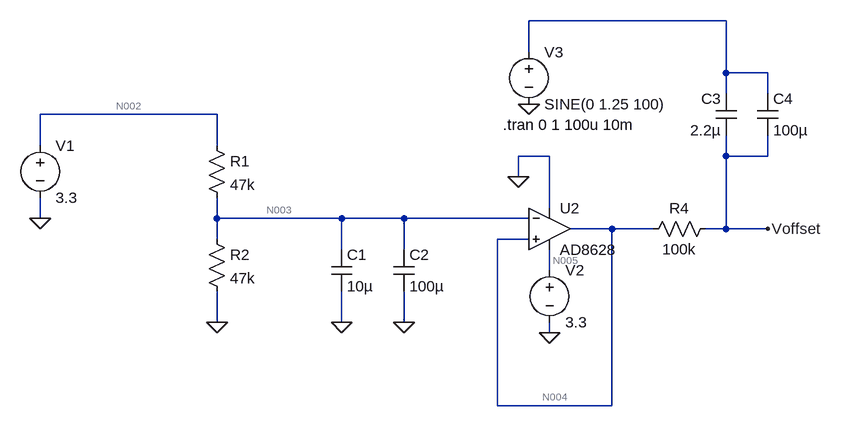
[diagram p0: schematic Voffset_1_65_V.asc]
Voffset_1_65_V.asc, the LTspice schematic file:
Version 4.1
SHEET 1 1412 680
WIRE 1072 -192 768 -192
WIRE 768 -144 768 -192
WIRE 1072 -112 1072 -192
WIRE 1136 -112 1072 -112
WIRE 1072 -80 1072 -112
WIRE 1136 -80 1136 -112
WIRE 288 -48 16 -48
WIRE 16 0 16 -48
WIRE 288 0 288 -48
WIRE 800 16 752 16
WIRE 1072 16 1072 -16
WIRE 1136 16 1136 -16
WIRE 1136 16 1072 16
WIRE 752 48 752 16
WIRE 800 96 800 16
WIRE 16 112 16 80
WIRE 288 112 288 80
WIRE 480 112 288 112
WIRE 576 112 480 112
WIRE 768 112 576 112
WIRE 896 128 832 128
WIRE 960 128 896 128
WIRE 1072 128 1072 16
WIRE 1072 128 1040 128
WIRE 1136 128 1072 128
WIRE 288 144 288 112
WIRE 768 144 720 144
WIRE 480 160 480 112
WIRE 576 160 576 112
WIRE 800 192 800 160
WIRE 288 272 288 224
WIRE 480 272 480 224
WIRE 576 272 576 224
WIRE 800 288 800 272
WIRE 720 400 720 144
WIRE 896 400 896 128
WIRE 896 400 720 400
FLAG 16 112 0
FLAG 288 272 0
FLAG 480 272 0
FLAG 576 272 0
FLAG 1136 128 Voffset
FLAG 800 288 0
FLAG 752 48 0
FLAG 768 -64 0
SYMBOL voltage 16 -16 R0
WINDOW 123 0 0 Left 0
WINDOW 39 0 0 Left 0
SYMATTR InstName V1
SYMATTR Value 3.3
SYMBOL res 272 -16 R0
SYMATTR InstName R1
SYMATTR Value 47k
SYMBOL res 272 128 R0
SYMATTR InstName R2
SYMATTR Value 47k
SYMBOL cap 464 160 R0
SYMATTR InstName C1
SYMATTR Value 10µ
SYMBOL cap 560 160 R0
SYMATTR InstName C2
SYMATTR Value 100µ
SYMBOL voltage 800 176 R0
WINDOW 123 0 0 Left 0
WINDOW 39 0 0 Left 0
SYMATTR InstName V2
SYMATTR Value 3.3
SYMBOL OpAmps\\AD8628 800 64 R0
SYMATTR InstName U2
SYMBOL voltage 768 -160 R0
WINDOW 123 0 0 Left 0
WINDOW 39 0 0 Left 0
SYMATTR InstName V3
SYMATTR Value SINE(0 1.25 100)
SYMBOL res 1056 112 R90
WINDOW 0 0 56 VBottom 2
WINDOW 3 32 56 VTop 2
SYMATTR InstName R4
SYMATTR Value 100k
SYMBOL cap 1088 -16 R180
WINDOW 0 24 56 Left 2
WINDOW 3 24 8 Left 2
SYMATTR InstName C3
SYMATTR Value 2.2µ
SYMBOL cap 1120 -80 R0
SYMATTR InstName C4
SYMATTR Value 100µ
TEXT 728 -32 Left 2 !.tran 0 1 100u 10m

The netlist it stands for:
* Voffset_1_65_V.asc
V1 N002 0 3.3
R1 N002 N003 47k
R2 N003 0 47k
C1 N003 0 10µ
C2 N003 0 100µ
V2 N005 0 3.3
X§U2 N004 N003 0 N005 N004 AD8628  ; pins In+ In- V+ V- OUT
V3 N001 0 SINE(0 1.25 100)
R4 Voffset N004 100k
C3 Voffset N001 2.2µ
C4 N001 Voffset 100µ
.tran 0 1 100u 10m
.backanno
.end

* Results of the author's LTspice run, read from the files saved beside the schematic
* Operating Point, zero values left out:
*   V(n002) = 3.3 V
*   V(n003) = 1.65 V
*   V(n004) = 1.65 V
*   V(n005) = 3.3 V
*   V(voffset) = 1.65 V
*   I(R1) = 35.11 µA
*   I(R2) = 35.11 µA
*   I(V1) = -35.11 µA
*   I(V2) = -3.15 mA
*   Ix(u2:1) = 29.09 pA
*   Ix(u2:2) = -19.1 pA
*   Ix(u2:3) = -3.15 mA
*   Ix(u2:4) = 3.15 mA
*   Ix(u2:5) = -28.9 pA
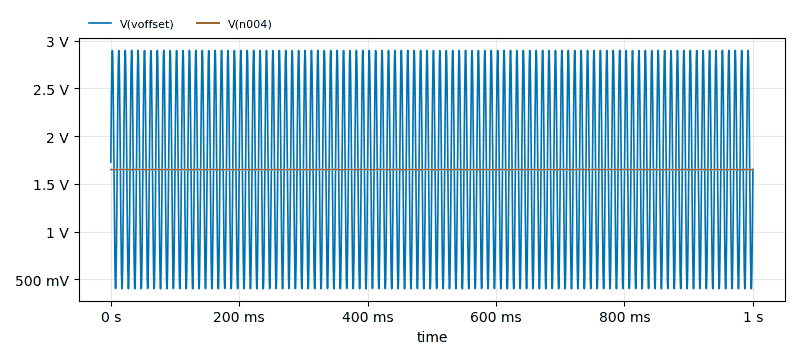
[diagram p1: Transient Analysis of Voffset_1_65_V.asc, plotted from the saved traces]
* Transient Analysis, 1 run:
*   V(voffset): min 399.8 mV, max 2.9 V, average 1.65 V, rms 1.879 V, last 1.65 V
*   V(n004): min 1.65 V, max 1.65 V, average 1.65 V, rms 1.65 V, last 1.65 V